# Altium schematic sheet Current-LoadSwitches PMS.SchDoc
size A
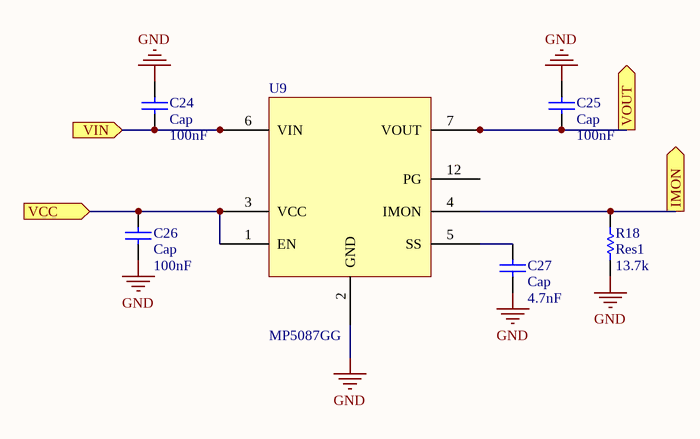
[diagram p0: Current-LoadSwitches PMS.SchDoc]

## Parts
C24  Cap  value 100nF  [0402-A]
C25  Cap  value 100nF  [0402-A]
C26  Cap  value 100nF  [0402-A]
C27  Cap  value 4.7nF  [0402-A]
R18  Res1  value 13.7k  [0402-A]
U9  MP5087GG  [MP5087GG-Z]

## Ports
IMON (out), VCC (in), VIN (in), VOUT (out)

## Nets
GND: C24.2 C25.2 C26.1 C27.1 R18.1 U9.2(GND)
IMON: R18.2 U9.4(IMON) ; port IMON
VCC: C26.2 U9.1(EN) U9.3(VCC) ; port VCC
VIN: C24.1 U9.6(VIN) U9.11(VOUT) ; port VIN
VOUT: C25.1 U9.7(VOUT) U9.8(VOUT) U9.9(VOUT) U9.10(VOUT) ; port VOUT
NetC27_2: C27.2 U9.5(SS)

Not connected (* = marked no-connect by the designer): U9 12(PG)

## Library data of the parts
C24-C27 = Cap: Capacitor; Published: 8-Jun-2000; LatestRevisionDate: 17-Jul-2002; LatestRevisionNote: Re-released for DXP Platform.; PackageReference: RAD-0.3; Publisher: Altium Limited; PackageDescription: Radial Cap, Thru-Hole; 2 Leads; 0.3 in Pin Spacing
R18 = Res1: Resistor; Published: 8-Jun-2000; LatestRevisionDate: 17-Jul-2002; LatestRevisionNote: Re-released for DXP Platform.; PackageReference: AXIAL-0.3; Publisher: Altium Limited; PackageDescription: Axial Device, Thru-Hole; 2 Leads; 0.3 in Pin Spacing
U9 = Component_1